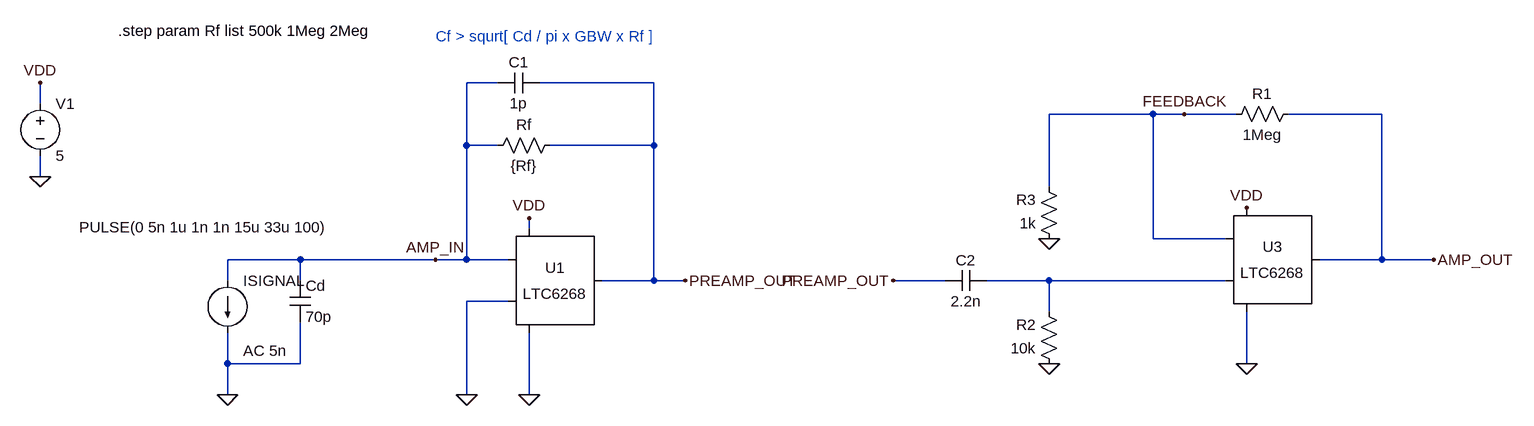
[diagram p0: schematic Ampli_simu.asc]
Ampli_simu.asc, the LTspice schematic file:
Version 4
SHEET 1 3004 684
WIRE 176 -128 128 -128
WIRE 416 -128 240 -128
WIRE -528 -96 -528 -128
WIRE 1184 -80 1024 -80
WIRE 1232 -80 1184 -80
WIRE 1312 -80 1232 -80
WIRE 1536 -80 1392 -80
WIRE 128 -32 128 -128
WIRE 176 -32 128 -32
WIRE 416 -32 416 -128
WIRE 416 -32 256 -32
WIRE -528 16 -528 -16
WIRE 1024 32 1024 -80
WIRE 224 96 224 80
WIRE 1184 112 1184 -80
WIRE 1296 112 1184 112
WIRE -128 144 -240 144
WIRE 80 144 -128 144
WIRE 128 144 128 -32
WIRE 128 144 80 144
WIRE 192 144 128 144
WIRE 1536 144 1536 -80
WIRE 1536 144 1440 144
WIRE 1616 144 1536 144
WIRE -240 176 -240 144
WIRE -128 176 -128 144
WIRE 416 176 416 -32
WIRE 416 176 336 176
WIRE 464 176 416 176
WIRE 864 176 784 176
WIRE 1024 176 928 176
WIRE 1296 176 1024 176
WIRE 192 208 128 208
WIRE 1024 224 1024 176
WIRE -240 304 -240 256
WIRE -128 304 -128 240
WIRE -128 304 -240 304
WIRE 1328 304 1328 224
WIRE -240 352 -240 304
WIRE 128 352 128 208
WIRE 224 352 224 256
FLAG 224 352 0
FLAG 128 352 0
FLAG 224 80 VDD
FLAG -240 352 0
FLAG -528 16 0
FLAG -528 -128 VDD
FLAG 464 176 PREAMP_OUT
FLAG 1616 144 AMP_OUT
FLAG 1024 304 0
FLAG 1328 304 0
FLAG 1328 64 VDD
FLAG 1024 112 0
FLAG 784 176 PREAMP_OUT
FLAG 80 144 AMP_IN
FLAG 1232 -80 FEEDBACK
SYMBOL OpAmps\\LTC6268 224 176 R0
SYMATTR InstName U1
SYMBOL res 272 -48 R90
WINDOW 0 0 56 VBottom 2
WINDOW 3 32 56 VTop 2
SYMATTR InstName Rf
SYMATTR Value {Rf}
SYMBOL cap -144 176 R0
SYMATTR InstName Cd
SYMATTR Value 70p
SYMBOL current -240 176 R0
WINDOW 3 -228 -82 Left 2
WINDOW 123 24 108 Left 2
WINDOW 39 0 0 Left 0
SYMATTR Value PULSE(0 5n 1u 1n 1n 15u 33u 100)
SYMATTR Value2 AC 5n
SYMATTR InstName ISIGNAL
SYMBOL voltage -528 -112 R0
WINDOW 123 0 0 Left 0
WINDOW 39 0 0 Left 0
SYMATTR InstName V1
SYMATTR Value 5
SYMBOL cap 928 160 R90
WINDOW 0 0 32 VBottom 2
WINDOW 3 32 32 VTop 2
SYMATTR InstName C2
SYMATTR Value 2.2n
SYMBOL res 1040 320 R180
WINDOW 0 36 76 Left 2
WINDOW 3 36 40 Left 2
SYMATTR InstName R2
SYMATTR Value 10k
SYMBOL OpAmps\\LTC6268 1328 144 R0
SYMATTR InstName U3
SYMBOL res 1408 -96 R90
WINDOW 0 0 56 VBottom 2
WINDOW 3 32 56 VTop 2
SYMATTR InstName R1
SYMATTR Value 1Meg
SYMBOL res 1040 128 R180
WINDOW 0 36 76 Left 2
WINDOW 3 36 40 Left 2
SYMATTR InstName R3
SYMATTR Value 1k
SYMBOL cap 240 -144 R90
WINDOW 0 0 32 VBottom 2
WINDOW 3 32 32 VTop 2
SYMATTR InstName C1
SYMATTR Value 1p
TEXT 80 -200 Left 2 ;Cf > squrt[ Cd / pi x GBW x Rf ]
TEXT -408 -208 Left 2 !.step param Rf list 500k 1Meg 2Meg

The netlist it stands for:
* Ampli_simu.asc
XU1 0 AMP_IN PREAMP_OUT VDD 0 NC_01 LTC6268
Rf PREAMP_OUT AMP_IN {Rf}
Cd AMP_IN 0 70p
ISIGNAL AMP_IN 0 PULSE(0 5n 1u 1n 1n 15u 33u 100) AC 5n
V1 VDD 0 5
C2 N001 PREAMP_OUT 2.2n
R2 0 N001 10k
XU3 N001 FEEDBACK AMP_OUT VDD 0 NC_02 LTC6268
R1 AMP_OUT FEEDBACK 1Meg
R3 0 FEEDBACK 1k
C1 PREAMP_OUT AMP_IN 1p
* Cf > squrt[ Cd / pi x GBW x Rf ]
.step param Rf list 500k 1Meg 2Meg
.lib LTC2.lib
.backanno
.end